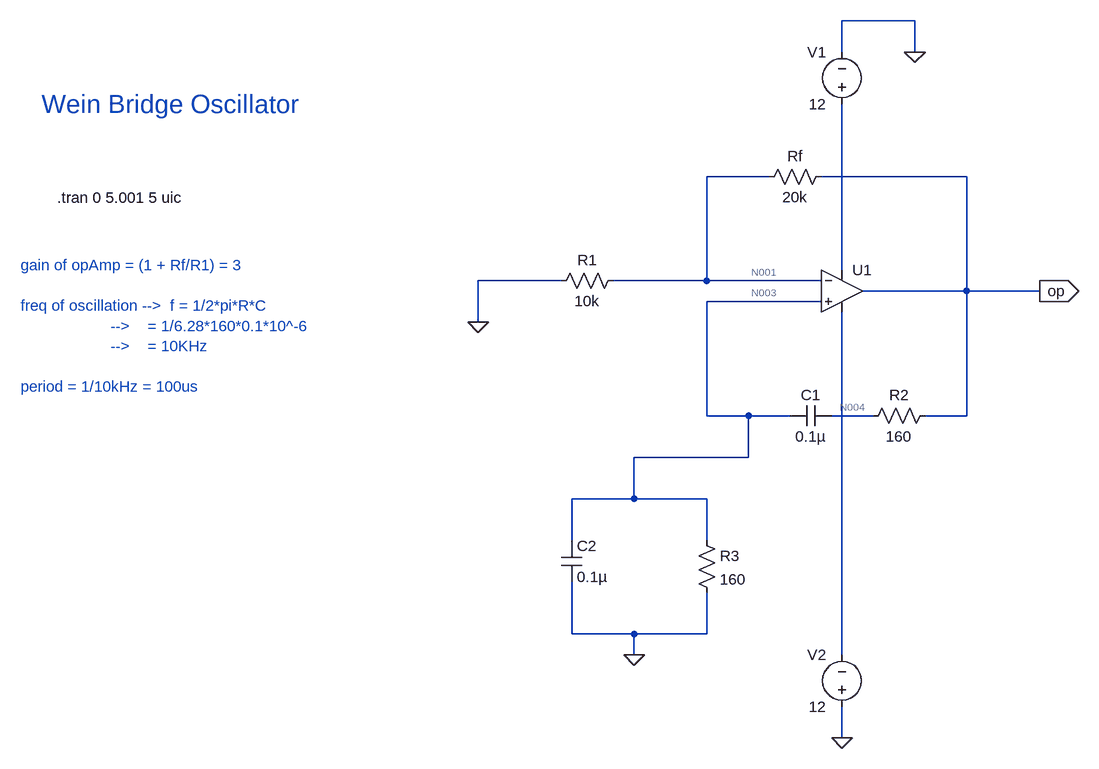
[diagram p0: schematic Wein_Bridge_Oscillator.asc]
Wein_Bridge_Oscillator.asc, the LTspice schematic file:
Version 4.1
SHEET 1 880 868
WIRE 336 -256 224 -256
WIRE 224 -208 224 -256
WIRE 336 -208 336 -256
WIRE 112 -16 16 -16
WIRE 416 -16 192 -16
WIRE 224 128 224 -128
WIRE -208 144 -336 144
WIRE 16 144 16 -16
WIRE 16 144 -128 144
WIRE 192 144 16 144
WIRE 416 160 416 -16
WIRE 416 160 256 160
WIRE 528 160 416 160
WIRE 192 176 16 176
WIRE -336 208 -336 144
WIRE 16 352 16 176
WIRE 80 352 16 352
WIRE 144 352 80 352
WIRE 272 352 208 352
WIRE 416 352 416 160
WIRE 416 352 352 352
WIRE 80 416 80 352
WIRE 80 416 -96 416
WIRE -96 480 -96 416
WIRE -96 480 -192 480
WIRE 16 480 -96 480
WIRE -192 544 -192 480
WIRE 16 544 16 480
WIRE -192 688 -192 608
WIRE -96 688 -192 688
WIRE 16 688 16 624
WIRE 16 688 -96 688
WIRE -96 720 -96 688
WIRE 224 720 224 192
WIRE 224 848 224 800
FLAG 336 -208 0
FLAG 224 848 0
FLAG -336 208 0
FLAG -96 720 0
FLAG 528 160 op
IOPIN 528 160 Out
SYMBOL OpAmps\\UniversalOpAmp2 224 160 R0
SYMATTR InstName U1
SYMBOL voltage 224 -112 R180
WINDOW 0 24 96 Left 2
WINDOW 3 24 16 Left 2
WINDOW 123 0 0 Left 0
WINDOW 39 0 0 Left 0
SYMATTR InstName V1
SYMATTR Value 12
SYMBOL voltage 224 816 R180
WINDOW 0 24 96 Left 2
WINDOW 3 24 16 Left 2
WINDOW 123 0 0 Left 0
WINDOW 39 0 0 Left 0
SYMATTR InstName V2
SYMATTR Value 12
SYMBOL res 208 -32 R90
WINDOW 0 0 56 VBottom 2
WINDOW 3 32 56 VTop 2
SYMATTR InstName Rf
SYMATTR Value 20k
SYMBOL res -112 128 R90
WINDOW 0 0 56 VBottom 2
WINDOW 3 32 56 VTop 2
SYMATTR InstName R1
SYMATTR Value 10k
SYMBOL res 368 336 R90
WINDOW 0 0 56 VBottom 2
WINDOW 3 32 56 VTop 2
SYMATTR InstName R2
SYMATTR Value 160
SYMBOL cap 208 336 R90
WINDOW 0 0 32 VBottom 2
WINDOW 3 32 32 VTop 2
SYMATTR InstName C1
SYMATTR Value 0.1µ
SYMBOL cap -208 544 R0
SYMATTR InstName C2
SYMATTR Value 0.1µ
SYMBOL res 0 528 R0
SYMATTR InstName R3
SYMATTR Value 160
TEXT -984 16 Left 2 !.tran 0 5.001 5 uic
TEXT -1008 -128 Left 4 ;Wein Bridge Oscillator
TEXT -1040 120 Left 2 ;gain of opAmp = (1 + Rf/R1) = 3 \n \nfreq of oscillation -->  f = 1/2*pi*R*C\n                    -->    = 1/6.28*160*0.1*10^-6\n                    -->    = 10KHz\n \nperiod = 1/10kHz = 100us

The netlist it stands for:
* Wein_Bridge_Oscillator.asc
X§U1 N003 N001 N002 N005 op level2 Avol=1Meg GBW=10Meg Slew=10Meg Ilimit=25m Rail=0 Vos=0 En=0 Enk=0 In=0 Ink=0 Rin=500Meg  ; pins In+ In- V+ V- OUT
V1 N002 0 12
V2 0 N005 12
Rf op N001 20k
R1 N001 0 10k
R2 op N004 160
C1 N004 N003 0.1µ
C2 N003 0 0.1µ
R3 N003 0 160
.tran 0 5.001 5 uic
* Wein Bridge Oscillator
* gain of opAmp = (1 + Rf/R1) = 3
* freq of oscillation -->  f = 1/2*pi*R*C
*                     -->    = 1/6.28*160*0.1*10^-6
*                     -->    = 10KHz
* period = 1/10kHz = 100us
.lib UniversalOpAmp2.lib
.backanno
.end

* Results of the author's LTspice run, read from the files saved beside the schematic
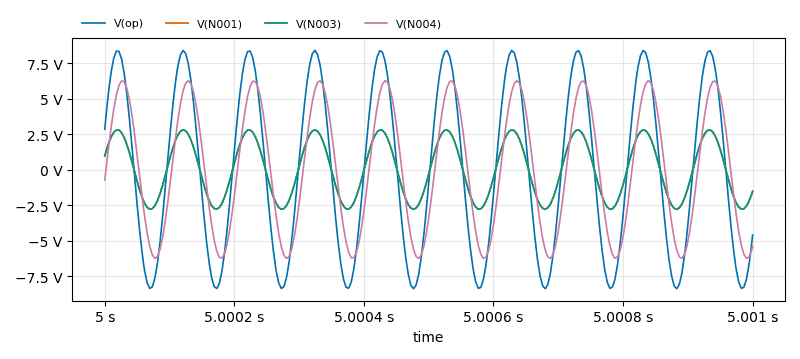
[diagram p1: Transient Analysis of Wein_Bridge_Oscillator.asc, plotted from the saved traces]
* Transient Analysis, 1 run:
*   V(op): min -8.401 V, max 8.396 V, average 14.02 mV, rms 5.974 V, last -4.608 V
*   V(N001): min -2.8 V, max 2.799 V, average 4.672 mV, rms 1.991 V, last -1.536 V
*   V(N003): min -2.8 V, max 2.798 V, average 4.552 mV, rms 1.991 V, last -1.529 V
*   V(N004): min -6.263 V, max 6.266 V, average 49.17 mV, rms 4.441 V, last -5.413 V